# EAGLE schematic prototype card (EAGLE 9.6.2)
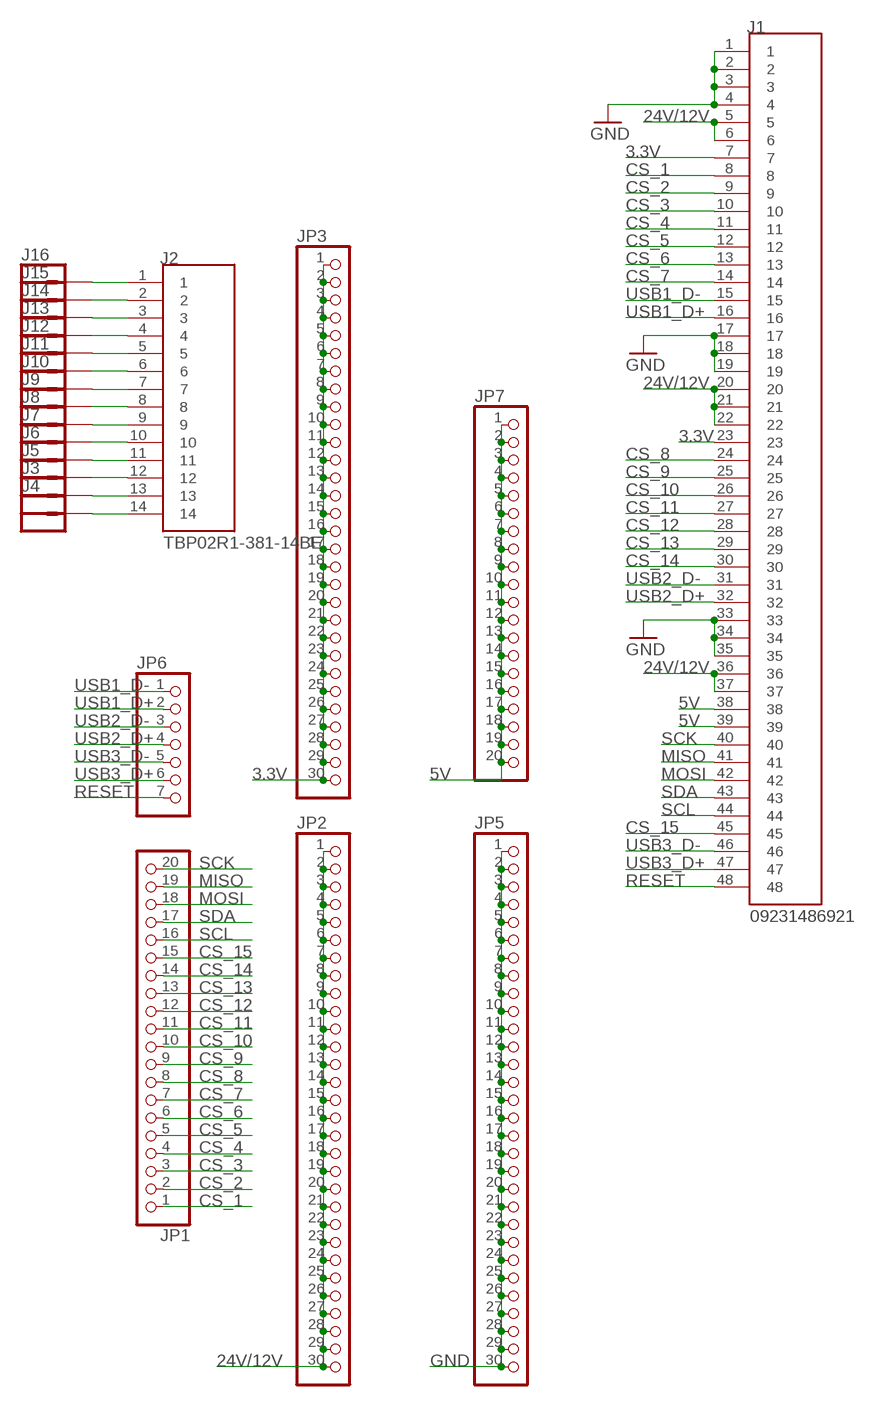
[diagram p0: schematic, sheet 1]

## Parts
J1  09231486921  [HARTING_09231486921]
J2  TBP02R1-381-14BE  [CUI_TBP02R1-381-14BE]
J3  CONN_01PTH_LONGPAD  [1X01_LONGPAD]
J4  CONN_01PTH_LONGPAD  [1X01_LONGPAD]
J5  CONN_01PTH_LONGPAD  [1X01_LONGPAD]
J6  CONN_01PTH_LONGPAD  [1X01_LONGPAD]
J7  CONN_01PTH_LONGPAD  [1X01_LONGPAD]
J8  CONN_01PTH_LONGPAD  [1X01_LONGPAD]
J9  CONN_01PTH_LONGPAD  [1X01_LONGPAD]
J10  CONN_01PTH_LONGPAD  [1X01_LONGPAD]
J11  CONN_01PTH_LONGPAD  [1X01_LONGPAD]
J12  CONN_01PTH_LONGPAD  [1X01_LONGPAD]
J13  CONN_01PTH_LONGPAD  [1X01_LONGPAD]
J14  CONN_01PTH_LONGPAD  [1X01_LONGPAD]
J15  CONN_01PTH_LONGPAD  [1X01_LONGPAD]
J16  CONN_01PTH_LONGPAD  [1X01_LONGPAD]
JP1  PINHD-1X20  [1X20]
JP2  PINHD-1X30  [1X30]
JP3  PINHD-1X30  [1X30]
JP5  PINHD-1X30  [1X30]
JP6  PINHD-1X7  [1X07]
JP7  PINHD-1X20  [1X20]

## Nets
3.3V: J1.7 J1.23 JP3.1 JP3.2 JP3.3 JP3.4 JP3.5 JP3.6 JP3.7 JP3.8 JP3.9 JP3.10 JP3.11 JP3.12 JP3.13 JP3.14 JP3.15 JP3.16 JP3.17 JP3.18 JP3.19 JP3.20 JP3.21 JP3.22 JP3.23 JP3.24 JP3.25 JP3.26 JP3.27 JP3.28 JP3.29 JP3.30
5V: J1.38 J1.39 JP7.1 JP7.2 JP7.3 JP7.4 JP7.5 JP7.6 JP7.7 JP7.8 JP7.9 JP7.10 JP7.11 JP7.12 JP7.13 JP7.14 JP7.15 JP7.16 JP7.17 JP7.18 JP7.19 JP7.20
24V/12V: J1.5 J1.6 J1.20 J1.21 J1.22 J1.36 J1.37 JP2.1 JP2.2 JP2.3 JP2.4 JP2.5 JP2.6 JP2.7 JP2.8 JP2.9 JP2.10 JP2.11 JP2.12 JP2.13 JP2.14 JP2.15 JP2.16 JP2.17 JP2.18 JP2.19 JP2.20 JP2.21 JP2.22 JP2.23 JP2.24 JP2.25 JP2.26 JP2.27 JP2.28 JP2.29 JP2.30
CS_1: J1.8 JP1.1
CS_2: J1.9 JP1.2
CS_3: J1.10 JP1.3
CS_4: J1.11 JP1.4
CS_5: J1.12 JP1.5
CS_6: J1.13 JP1.6
CS_7: J1.14 JP1.7
CS_8: J1.24 JP1.8
CS_9: J1.25 JP1.9
CS_10: J1.26 JP1.10
CS_11: J1.27 JP1.11
CS_12: J1.28 JP1.12
CS_13: J1.29 JP1.13
CS_14: J1.30 JP1.14
CS_15: J1.45 JP1.15
GND: J1.1 J1.2 J1.3 J1.4 J1.17 J1.18 J1.19 J1.33 J1.34 J1.35 JP5.1 JP5.2 JP5.3 JP5.4 JP5.5 JP5.6 JP5.7 JP5.8 JP5.9 JP5.10 JP5.11 JP5.12 JP5.13 JP5.14 JP5.15 JP5.16 JP5.17 JP5.18 JP5.19 JP5.20 JP5.21 JP5.22 JP5.23 JP5.24 JP5.25 JP5.26 JP5.27 JP5.28 JP5.29 JP5.30
MISO: J1.41 JP1.19
MOSI: J1.42 JP1.18
N$1: J2.14 J4.1
N$2: J2.13 J3.1
N$4: J2.12 J5.1
N$5: J2.11 J6.1
N$6: J2.10 J7.1
N$7: J2.9 J8.1
N$8: J2.8 J9.1
N$9: J2.7 J10.1
N$10: J2.6 J11.1
N$11: J2.5 J12.1
N$12: J2.4 J13.1
N$13: J2.3 J14.1
N$14: J2.2 J15.1
N$15: J2.1 J16.1
RESET: J1.48 JP6.7
SCK: J1.40 JP1.20
SCL: J1.44 JP1.16
SDA: J1.43 JP1.17
USB1_D+: J1.16 JP6.2
USB1_D-: J1.15 JP6.1
USB2_D+: J1.32 JP6.4
USB2_D-: J1.31 JP6.3
USB3_D+: J1.47 JP6.6
USB3_D-: J1.46 JP6.5

## Library data of the parts
J1 = din41612_48_pin_board:09231486921: Check prices <https://pricing.snapeda.com/parts/8-1393644-0/TE%20Connectivity/view-part?ref=eda>; MANUFACTURER-PART-NUMBER: 09231486921; PACKAGE: None
J2 = TBP02R1-381-14BE:TBP02R1-381-14BE: Check prices <https://pricing.snapeda.com/parts/TBP02R1-381-14BE/CUI%20Devices/view-part?ref=eda>; MANUFACTURER-PART-NUMBER: TBP02R1-381-14BE; PACKAGE: None
J3-J16 = SparkFun-Connectors:CONN_01: Single connection point. Often used as Generic Header-pin footprint for 0.1 inch spaced/style header connections On any of the 0.1 inch spaced packages, you can populate with these: Break Away Headers - Straight <https://www.sparkfun.com/products/116> (PRT-00116) Break Away Male Headers - Right Angle <https://www.sparkfun.com/products/553> (PRT-00553) Female Headers <https://www.sparkfun.com/products/115> (PRT-00115) Break Away Headers - Machine Pin <https://www.sparkfun.com/products/117> (PRT-00117) Break Away Female Headers - Swiss Machine Pin <https://www.sparkfun.com/products/743> (PRT-00743) This device is also useful as a general connection point to wire up your design to another part of your project. Our various solder wires solder well into these plated through hole pads. Hook-Up Wire - Assortment (Stranded, 22 AWG) <https://www.sparkfun.com/products/11375> (PRT-11375) Hook-Up Wire - Assortment (Solid Core, 22 AWG) <https://www.sparkfun.com/products/11367> (PRT-11367) View the entire wire category on our website here <https://www.sparkfun.com/categories/141> Special notes: SMTSO-256-ET is a "flush mount" nut for a 4-40 screw. We mostly use this on specialty testbeds; it is a nice way to connect hardware to your PCB at an adjustable hieght. Also note, the SNAP packages are for using a snappable style connector. We sell a baggie of snaps and they are also used on two LilyPad designs: Snap Assortment - 30 pack (male and female) <https://www.sparkfun.com/products/11347> (DEV-11347) LilyPad Arduino SimpleSnap <https://www.sparkfun.com/products/10941> (DEV-10941) LilyPad SimpleSnap Protoboard <https://www.sparkfun.com/products/10940> (DEV-10940)
JP1 JP7 = pinhead:PINHD-1X20: PIN HEADER
JP2 JP3 JP5 = pinhead:PINHD-1X30: PIN HEADER
JP6 = pinhead:PINHD-1X7: PIN HEADER

## Net classes
1 POWER: clearance 0.508 mm